# Altium schematic sheet SunS_fixture_EGSE_FTDI.SchDoc: Connectors
size A3; Author: Michał Gumiela; ProjectName: SunS
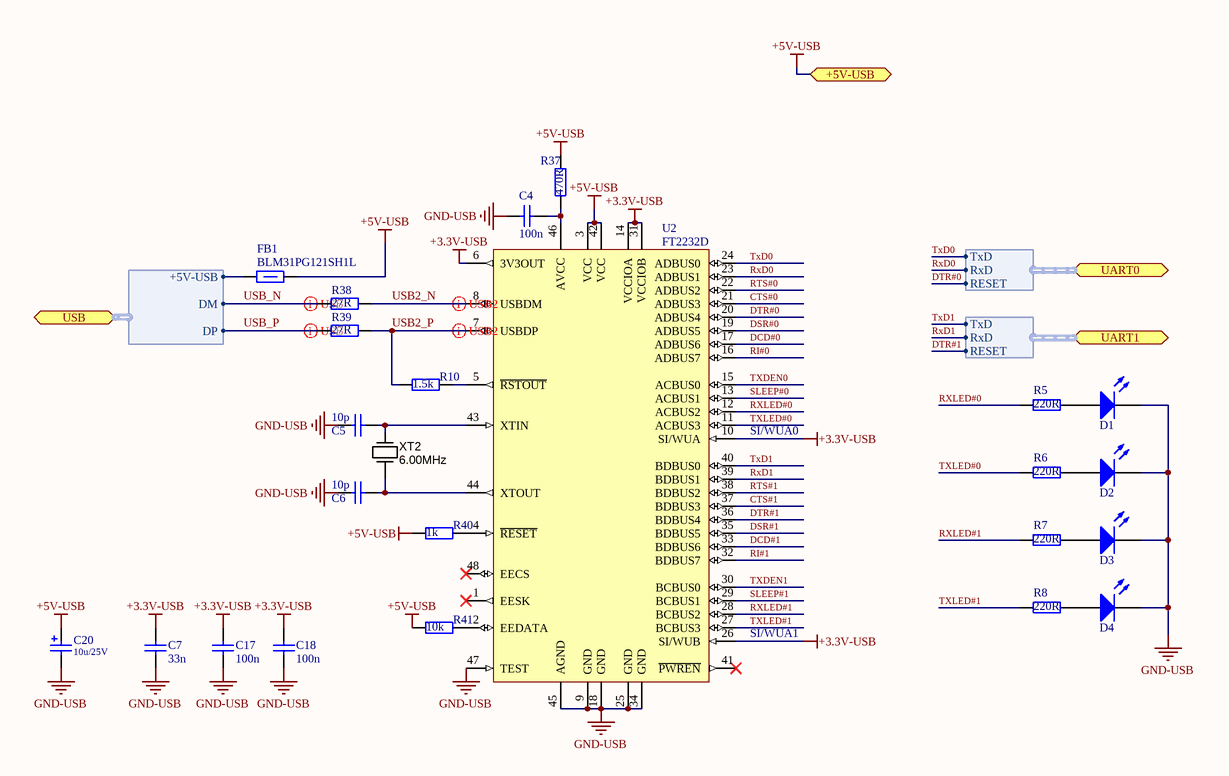
[diagram p0: SunS_fixture_EGSE_FTDI.SchDoc]

## Parts
C4  value 100n  [SMD_Capacitor_0603]  (hidden comment: Cap)
C5  value 10p  [SMD_Capacitor_0603]  (hidden comment: Cap)
C6  value 10p  [SMD_Capacitor_0603]  (hidden comment: Cap)
C7  value 33n  [SMD_Capacitor_0603]  (hidden comment: Cap)
C17  value 100n  [SMD_Capacitor_0603]  (hidden comment: Cap)
C18  value 100n  [SMD_Capacitor_0603]  (hidden comment: Cap)
C20  10u/25V  [Tantalum_cap_D]
D1  LEDX  [LED 0805 RED]  (value not drawn)
D2  LEDX  [LED 0805 RED]  (value not drawn)
D3  LEDX  [LED 0805 RED]  (value not drawn)
D4  LEDX  [LED 0805 RED]  (value not drawn)
FB1  120R/100MHz  [SMD_FerriteBead_1206]  (value not drawn)
R5  220R  [SMD_Resistor_0603]
R6  220R  [SMD_Resistor_0603]
R7  220R  [SMD_Resistor_0603]
R8  220R  [SMD_Resistor_0603]
R10  1.5k  [SMD_Resistor_0603]
R37  470R  [SMD_Resistor_0603]
R38  27R  [SMD_Resistor_0603]
R39  27R  [SMD_Resistor_0603]
R40  1k  [SMD_Resistor_0603]
R41  10k  [SMD_Resistor_0603]
U2  FT2232D  [LQFP-48_N]
XT2  6.00MHz  [HC49U]

## Ports
+5V-USB, UART0 (harness UART), UART1 (harness UART), USB (harness USB)

## Harnesses
USB: DM, DP, +5V-USB
UART: TxD, RxD, RESET

## Nets
+3.3V-USB: C7.1 C17.1 C18.1 U2.6(3V3OUT) U2.10(SI/WUA) U2.14(VCCIOA) U2.26(SI/WUB) U2.31(VCCIOB)
+5V-USB: C20.1 FB1.1 R37.2 R40.1 R41.1 U2.3(VCC) U2.42(VCC) ; port +5V-USB
GND-USB: C4.2 C5.2 C6.2 C7.2 C17.2 C18.2 C20.2 D1.2(K) D2.2(K) D3.2(K) D4.2(K) U2.9(GND) U2.18(GND) U2.25(GND) U2.34(GND) U2.45(AGND) U2.47(TEST)
CTS#0: U2.21(ADBUS3)
CTS#1: U2.37(BDBUS3)
DCD#0: U2.17(ADBUS6)
DCD#1: U2.33(BDBUS6)
DSR#0: U2.19(ADBUS5)
DSR#1: U2.35(BDBUS5)
DTR#0: U2.20(ADBUS4) ; port UART0.RESET
DTR#1: U2.36(BDBUS4) ; port UART1.RESET
RI#0: U2.16(ADBUS7)
RI#1: U2.32(BDBUS7)
RTS#0: U2.22(ADBUS2)
RTS#1: U2.38(BDBUS2)
RxD0: U2.23(ADBUS1) ; port UART0.RxD
RxD1: U2.39(BDBUS1) ; port UART1.RxD
RXLED#0: R5.1 U2.12(ACBUS2)
RXLED#1: R7.1 U2.28(BCBUS2)
SLEEP#0: U2.13(ACBUS1)
SLEEP#1: U2.29(BCBUS1)
TxD0: U2.24(ADBUS0) ; port UART0.TxD
TxD1: U2.40(BDBUS0) ; port UART1.TxD
TXDEN0: U2.15(ACBUS0)
TXDEN1: U2.30(BCBUS0)
TXLED#0: R6.1 U2.11(ACBUS3)
TXLED#1: R8.1 U2.27(BCBUS3)
USB2_N: R38.1 U2.8(USBDM)
USB2_P: R10.1 R39.1 U2.7(USBDP)
USB_N: R38.2 ; port USB.DM
USB_P: R39.2 ; port USB.DP
NetC4_1: C4.1 R37.1 U2.46(AVCC)
NetC5_1: C5.1 U2.43(XTIN) XT2.2(OUT)
NetC6_1: C6.1 U2.44(XTOUT) XT2.1(IN)
NetD1_1: D1.1(A) R5.2
NetD2_1: D2.1(A) R6.2
NetD3_1: D3.1(A) R7.2
NetD4_1: D4.1(A) R8.2
NetFB1_2: FB1.2 ; port USB.+5V-USB
NetR10_2: R10.2 U2.5(~{RSTOUT})
NetR40_2: R40.2 U2.4(~{RESET})
NetR41_2: R41.2 U2.2(EEDATA)

Not connected (* = marked no-connect by the designer): U2 1(EESK)* 41(~{PWREN})* 48(EECS)*

## Layout directives
differential pair: USB2_N, USB2_P, USB_N, USB_P

## Notes on the sheet
- (near U2) SI/WUA0
- (near U2) SI/WUA1
- Title:
- Project:
- Author:
- Model:
- Document Number:
- Checked by:
- Rev:
- Date:
- Approved by:
- Sheet:
- of
- File name:

## Library data of the parts
C20 = TantS_CWR11_10u_25V: Tantalum Capacitor CWR11 10u/22V.; ManufacturerPartNumber: CWR11K(6)106(1)(2)(5); Manufacturer: Kemet; Value: 10u/25V
D1-D4 = LEDX: Typical LED
FB1 = BLM31PG121SH1L: Ferrite bead, 1206, 0.02HM, 3.5A.; Manufacturer: Murata; Current Rating: 3.5A; Series Resistance DC: 0.02R; Package: 1206; Value: 120R/100MHz; ManufacturerPartNumber: BLM31PG121SH1L
R5-R8 R10 R37-R41 = Res: Package: 0603
  R5-R8: Value: 220R
  R10: Value: 1.5k
  R37: Value: 470R
  R38 R39: Value: 27R
  R40: Value: 1k
  R41: Value: 10k
U2 = FT2232D: FT2232D Dual USB to Serial UART/FIFO IC, -40 to +85 degC, 48-pin LQFP; Manufacturer: FTDI; DatasheetVersion: ver 2.05, Apr-2011; PackageVersion: Apr-11; PackageReference: LQFP-48; PackageDescription: 48-Pin Thin Quad Flat Pack, 7 x 7 mm Body, 0.5 mm Pitch; PartNumber: FT2232D; ComponentLink1Description: Manufacturer URL; ComponentLink1URL: http://www.ftdichip.com/; ComponentLink2Description: Datasheet; ComponentLink2URL: http://www.ftdichip.com/Support/Documents/DataSheets/ICs/DS_FT2232D.pdf
XT2 = Crystal: Resonator Ceramic; Manufacturer 1: Citizen Finetech Miyota; Manufacturer Part Number 1: CMR309T-6.000MABJ-UT; Frequency: 6MHz; Frequency Stability: ±50ppm; Frequency Tolerance: ±30ppm; Load Capacitance: 18pF; Operating Mode: Fundamental; SCDType: spec; Package / Case: Cylindrical Can, Radial; Ratings: 6.00 MHz; Type: MHz Crystal; Operating Temperature: -10°C ~ 60°C; Mounting Type: Surface Mount; Size / Dimension: 0.118" Dia x 0.346" L (3.00mm x 8.80mm); Height: 0.122" (3.10mm); Supplier 1: Digi-Key; Supplier Part Number 1: 300-8348-1-ND; Tolerance: ±50ppm; ComponentLink1URL: http://media.digikey.com/pdf/Data%20Sheets/Citizen%20PDFs/CMR310T%20CMR309T.pdf; ComponentLink1Description: http://media.digikey.com/pdf/Data%20Sheets/Citizen%20PDFs/CMR310T%20CMR309T.pdf; Value: 6.00MHz
C4-C7 C17 C18 = Cap: Package: 0603